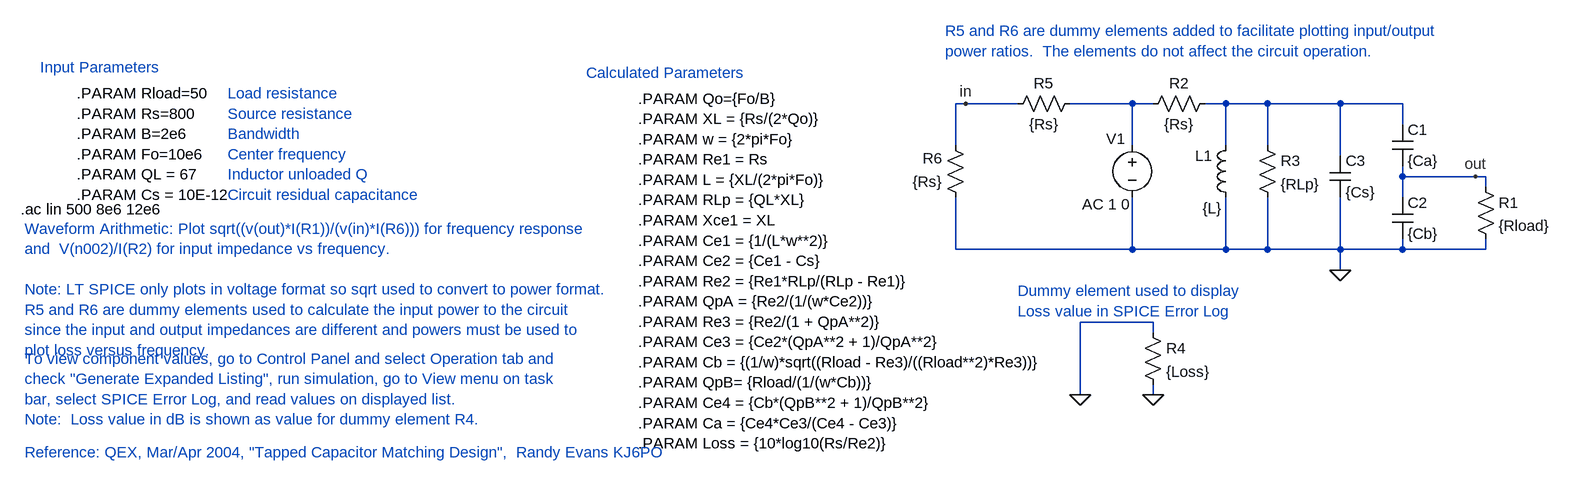
[diagram p0: schematic Tapped Capacitor Matching RevA.asc]
Tapped Capacitor Matching RevA.asc, the LTspice schematic file:
Version 4
SHEET 1 2012 776
WIRE 1264 -32 1264 -96
WIRE 1264 -96 1296 -96
WIRE 1680 -96 1680 -64
WIRE 1584 -16 1584 -96
WIRE 1584 -96 1680 -96
WIRE 1408 -32 1408 -96
WIRE 1408 -96 1472 -96
WIRE 1264 48 1264 128
WIRE 1264 128 1408 128
WIRE 1680 128 1680 112
WIRE 1680 128 1808 128
WIRE 1808 128 1808 112
WIRE 1680 0 1680 16
WIRE 1584 48 1584 128
WIRE 1584 128 1680 128
WIRE 1408 48 1408 128
WIRE 1408 128 1472 128
WIRE 1808 32 1808 16
WIRE 1808 16 1792 16
WIRE 1680 16 1680 48
WIRE 1376 -96 1408 -96
WIRE 1584 160 1584 128
WIRE 1792 16 1680 16
WIRE 1472 -32 1472 -96
WIRE 1472 -96 1584 -96
WIRE 1472 48 1472 128
WIRE 1472 128 1584 128
WIRE 1296 256 1296 240
WIRE 1296 240 1184 240
WIRE 1184 240 1184 352
WIRE 1296 352 1296 336
WIRE 1264 -96 1168 -96
WIRE 1088 -96 1008 -96
WIRE 992 -96 992 -32
WIRE 992 48 992 128
WIRE 992 128 1264 128
WIRE 1008 -96 992 -96
FLAG 1584 160 0
FLAG 1792 16 out
FLAG 1296 352 0
FLAG 1184 352 0
FLAG 1008 -96 in
SYMBOL cap 1664 -64 R0
SYMATTR InstName C1
SYMATTR Value {Ca}
SYMBOL cap 1664 48 R0
SYMATTR InstName C2
SYMATTR Value {Cb}
SYMBOL cap 1568 -16 R0
SYMATTR InstName C3
SYMATTR Value {Cs}
SYMBOL ind 1424 64 R180
WINDOW 0 36 80 Left 0
WINDOW 3 22 -1 Left 0
SYMATTR InstName L1
SYMATTR Value {L}
SYMBOL res 1792 16 R0
SYMATTR InstName R1
SYMATTR Value {Rload}
SYMBOL voltage 1264 -48 R0
WINDOW 0 -40 6 Left 0
WINDOW 123 -77 107 Left 0
WINDOW 39 0 0 Left 0
SYMATTR InstName V1
SYMATTR Value2 AC 1 0
SYMATTR Value ""
SYMBOL res 1392 -112 R90
WINDOW 0 0 56 VBottom 0
WINDOW 3 32 56 VTop 0
SYMATTR InstName R2
SYMATTR Value {Rs}
SYMBOL res 1456 -48 R0
SYMATTR InstName R3
SYMATTR Value {RLp}
SYMBOL res 1280 240 R0
SYMATTR InstName R4
SYMATTR Value {Loss}
SYMBOL res 1184 -112 R90
WINDOW 0 0 56 VBottom 0
WINDOW 3 32 56 VTop 0
SYMATTR InstName R5
SYMATTR Value {Rs}
SYMBOL res 1008 64 R180
WINDOW 0 36 76 Left 0
WINDOW 3 36 40 Left 0
SYMATTR InstName R6
SYMATTR Value {Rs}
TEXT -360 -112 Left 0 !.PARAM Rload=50\n.PARAM Rs=800\n.PARAM B=2e6\n.PARAM Fo=10e6\n.PARAM QL = 67\n.PARAM Cs = 10E-12
TEXT 504 -104 Left 0 !.PARAM Qo={Fo/B}\n.PARAM XL = {Rs/(2*Qo)}\n.PARAM w = {2*pi*Fo}\n.PARAM Re1 = Rs\n.PARAM L = {XL/(2*pi*Fo)}\n.PARAM RLp = {QL*XL}\n.PARAM Xce1 = XL\n.PARAM Ce1 = {1/(L*w**2)}\n.PARAM Ce2 = {Ce1 - Cs}\n.PARAM Re2 = {Re1*RLp/(RLp - Re1)}\n.PARAM QpA = {Re2/(1/(w*Ce2))}\n.PARAM Re3 = {Re2/(1 + QpA**2)}\n.PARAM Ce3 = {Ce2*(QpA**2 + 1)/QpA**2}\n.PARAM Cb = {(1/w)*sqrt((Rload - Re3)/((Rload**2)*Re3))}\n.PARAM QpB= {Rload/(1/(w*Cb))}\n.PARAM Ce4 = {Cb*(QpB**2 + 1)/QpB**2}\n.PARAM Ca = {Ce4*Ce3/(Ce4 - Ce3)}\n.PARAM Loss = {10*log10(Rs/Re2)}
TEXT -416 -152 Left 0 ;Input Parameters
TEXT 424 -144 Left 0 ;Calculated Parameters
TEXT -446 66 Left 0 !.ac lin 500 8e6 12e6
TEXT -440 296 Left 0 ;To view component values, go to Control Panel and select Operation tab and \ncheck "Generate Expanded Listing", run simulation, go to View menu on task \nbar, select SPICE Error Log, and read values on displayed list.  \nNote:  Loss value in dB is shown as value for dummy element R4.
TEXT 1088 192 Left 0 ;Dummy element used to display \nLoss value in SPICE Error Log
TEXT -440 96 Left 0 ;Waveform Arithmetic: Plot sqrt((v(out)*I(R1))/(v(in)*I(R6))) for frequency response\nand  V(n002)/I(R2) for input impedance vs frequency.\n \nNote: LT SPICE only plots in voltage format so sqrt used to convert to power format.\nR5 and R6 are dummy elements used to calculate the input power to the circuit \nsince the input and output impedances are different and powers must be used to \nplot loss versus frequency.
TEXT -440 440 Left 0 ;Reference: QEX, Mar/Apr 2004, "Tapped Capacitor Matching Design",  Randy Evans KJ6PO
TEXT -128 -112 Left 0 ;Load resistance\nSource resistance\nBandwidth\nCenter frequency\nInductor unloaded Q\nCircuit residual capacitance
TEXT 976 -208 Left 0 ;R5 and R6 are dummy elements added to facilitate plotting input/output \npower ratios.  The elements do not affect the circuit operation.

The netlist it stands for:
* Tapped Capacitor Matching RevA.asc
C1 N002 out {Ca}
C2 out 0 {Cb}
C3 N002 0 {Cs}
L1 0 N002 {L}
R1 out 0 {Rload}
V1 N001 0 AC 1 0
R2 N002 N001 {Rs}
R3 N002 0 {RLp}
R4 0 0 {Loss}
R5 N001 in {Rs}
R6 0 in {Rs}
.PARAM Rload=50
.PARAM Rs=800
.PARAM B=2e6
.PARAM Fo=10e6
.PARAM QL = 67
.PARAM Cs = 10E-12
.PARAM Qo={Fo/B}
.PARAM XL = {Rs/(2*Qo)}
.PARAM w = {2*pi*Fo}
.PARAM Re1 = Rs
.PARAM L = {XL/(2*pi*Fo)}
.PARAM RLp = {QL*XL}
.PARAM Xce1 = XL
.PARAM Ce1 = {1/(L*w**2)}
.PARAM Ce2 = {Ce1 - Cs}
.PARAM Re2 = {Re1*RLp/(RLp - Re1)}
.PARAM QpA = {Re2/(1/(w*Ce2))}
.PARAM Re3 = {Re2/(1 + QpA**2)}
.PARAM Ce3 = {Ce2*(QpA**2 + 1)/QpA**2}
.PARAM Cb = {(1/w)*sqrt((Rload - Re3)/((Rload**2)*Re3))}
.PARAM QpB= {Rload/(1/(w*Cb))}
.PARAM Ce4 = {Cb*(QpB**2 + 1)/QpB**2}
.PARAM Ca = {Ce4*Ce3/(Ce4 - Ce3)}
.PARAM Loss = {10*log10(Rs/Re2)}
* Input Parameters
* Calculated Parameters
.ac lin 500 8e6 12e6
* To view component values, go to Control Panel and select Operation tab and
* check "Generate Expanded Listing", run simulation, go to View menu on task
* bar, select SPICE Error Log, and read values on displayed list.
* Note:  Loss value in dB is shown as value for dummy element R4.
* Dummy element used to display
* Loss value in SPICE Error Log
* Waveform Arithmetic: Plot sqrt((v(out)*I(R1))/(v(in)*I(R6))) for frequency response
* and  V(n002)/I(R2) for input impedance vs frequency.
* Note: LT SPICE only plots in voltage format so sqrt used to convert to power format.
* R5 and R6 are dummy elements used to calculate the input power to the circuit
* since the input and output impedances are different and powers must be used to
* plot loss versus frequency.
* Reference: QEX, Mar/Apr 2004, "Tapped Capacitor Matching Design",  Randy Evans KJ6PO
* Load resistance
* Source resistance
* Bandwidth
* Center frequency
* Inductor unloaded Q
* Circuit residual capacitance
* R5 and R6 are dummy elements added to facilitate plotting input/output
* power ratios.  The elements do not affect the circuit operation.
.backanno
.end